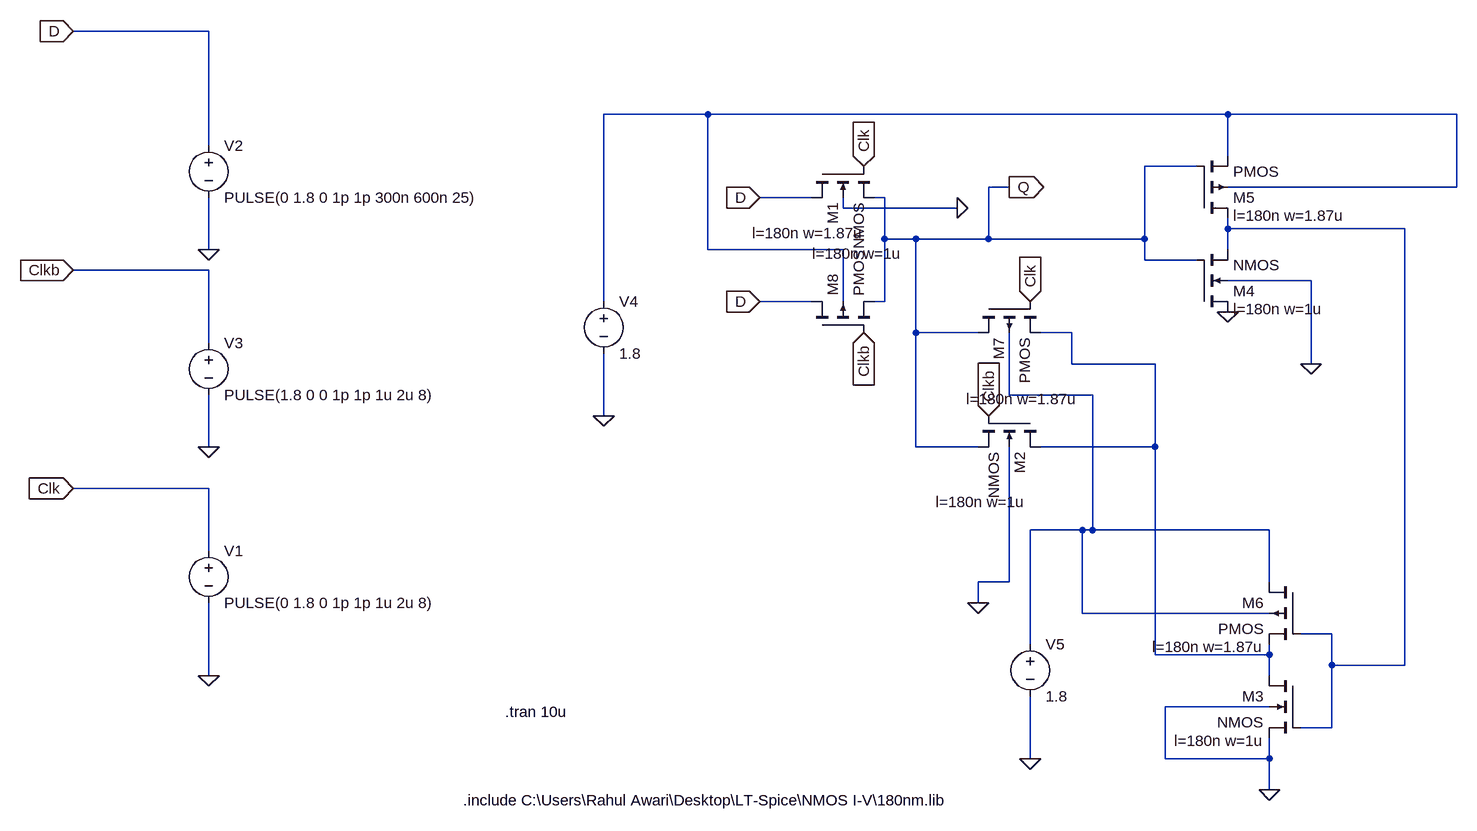
[diagram p0: schematic task4.asc]
task4.asc, the LTspice schematic file:
Version 4
SHEET 1 1328 704
WIRE -1040 -496 -1248 -496
WIRE -272 -368 -432 -368
WIRE 528 -368 -272 -368
WIRE 880 -368 528 -368
WIRE -1040 -320 -1040 -496
WIRE 528 -304 528 -368
WIRE 480 -288 400 -288
WIRE 192 -256 160 -256
WIRE 880 -256 880 -368
WIRE 880 -256 528 -256
WIRE -112 -240 -192 -240
WIRE 0 -240 -16 -240
WIRE -64 -224 -64 -240
WIRE 112 -224 -64 -224
WIRE 528 -192 528 -208
WIRE 800 -192 528 -192
WIRE 0 -176 0 -240
WIRE 48 -176 0 -176
WIRE 160 -176 160 -256
WIRE 160 -176 48 -176
WIRE 400 -176 400 -288
WIRE 400 -176 160 -176
WIRE -1040 -160 -1040 -240
WIRE -272 -160 -272 -368
WIRE -64 -160 -272 -160
WIRE 528 -160 528 -192
WIRE 400 -144 400 -176
WIRE 480 -144 400 -144
WIRE -1040 -128 -1248 -128
WIRE 656 -112 528 -112
WIRE -432 -80 -432 -368
WIRE -112 -80 -192 -80
WIRE -64 -80 -64 -160
WIRE 0 -80 0 -176
WIRE 0 -80 -16 -80
WIRE 48 -32 48 -176
WIRE 144 -32 48 -32
WIRE 288 -32 240 -32
WIRE -1040 -16 -1040 -128
WIRE 288 16 288 -32
WIRE 416 16 288 16
WIRE 656 16 656 -112
WIRE 192 64 192 -32
WIRE 320 64 192 64
WIRE -432 96 -432 0
WIRE -1040 144 -1040 64
WIRE 48 144 48 -32
WIRE 144 144 48 144
WIRE 416 144 416 16
WIRE 416 144 240 144
WIRE -1040 208 -1248 208
WIRE 304 272 224 272
WIRE 320 272 320 64
WIRE 320 272 304 272
WIRE 592 272 320 272
WIRE -1040 304 -1040 208
WIRE 192 352 192 144
WIRE 192 352 144 352
WIRE 592 352 592 272
WIRE 144 384 144 352
WIRE 304 400 304 272
WIRE 592 400 304 400
WIRE 688 432 640 432
WIRE 224 448 224 272
WIRE 416 464 416 144
WIRE 592 464 592 448
WIRE 592 464 416 464
WIRE 688 480 688 432
WIRE 800 480 800 -192
WIRE 800 480 688 480
WIRE -1040 496 -1040 384
WIRE 592 496 592 464
WIRE 592 544 432 544
WIRE 688 576 688 480
WIRE 688 576 640 576
WIRE 224 624 224 528
WIRE 432 624 432 544
WIRE 592 624 592 592
WIRE 592 624 432 624
WIRE 592 672 592 624
FLAG 528 -64 0
FLAG -192 -240 D
IOPIN -192 -240 In
FLAG -32 -32 Clkb
IOPIN -32 -32 In
FLAG 160 96 Clkb
IOPIN 160 96 In
FLAG -32 -288 Clk
IOPIN -32 -288 In
FLAG 224 -80 Clk
IOPIN 224 -80 In
FLAG 192 -256 Q
IOPIN 192 -256 Out
FLAG -1248 -496 D
IOPIN -1248 -496 In
FLAG -1248 -128 Clkb
IOPIN -1248 -128 In
FLAG -1040 -160 0
FLAG -1040 144 0
FLAG -1248 208 Clk
IOPIN -1248 208 In
FLAG -1040 496 0
FLAG -192 -80 D
IOPIN -192 -80 In
FLAG 656 16 0
FLAG 224 624 0
FLAG 592 672 0
FLAG 112 -224 0
FLAG 144 384 0
FLAG -432 96 0
SYMBOL nmos4 -112 -288 M90
WINDOW 123 134 139 VLeft 2
SYMATTR Value2 l=180n w=1u
SYMATTR InstName M1
SYMBOL nmos4 240 96 R90
WINDOW 123 133 23 VRight 2
SYMATTR Value2 l=180n w=1u
SYMATTR InstName M2
SYMBOL nmos4 640 496 M0
WINDOW 123 56 100 Left 2
SYMATTR Value2 l=180n w=1u
SYMATTR InstName M3
SYMBOL nmos4 480 -64 M180
WINDOW 123 56 4 Left 2
SYMATTR Value2 l=180n w=1u
SYMATTR InstName M4
SYMBOL pmos4 480 -208 M180
WINDOW 123 56 4 Left 2
SYMATTR Value2 l=180n w=1.87u
SYMATTR InstName M5
SYMBOL pmos4 640 352 M0
WINDOW 123 56 100 Left 2
SYMATTR Value2 l=180n w=1.87u
SYMATTR InstName M6
SYMBOL pmos4 144 -80 M90
WINDOW 123 150 154 VLeft 2
SYMATTR Value2 l=180n w=1.87u
SYMATTR InstName M7
SYMBOL pmos4 -112 -32 R270
WINDOW 123 153 -92 VRight 2
SYMATTR Value2 l=180n w=1.87u
SYMATTR InstName M8
SYMBOL voltage -1040 288 R0
WINDOW 123 0 0 Left 0
WINDOW 39 0 0 Left 0
SYMATTR InstName V1
SYMATTR Value PULSE(0 1.8 0 1p 1p 1u 2u 8)
SYMBOL voltage -1040 -336 R0
WINDOW 123 0 0 Left 0
WINDOW 39 0 0 Left 0
SYMATTR InstName V2
SYMATTR Value PULSE(0 1.8 0 1p 1p 300n 600n 25)
SYMBOL voltage -1040 -32 R0
WINDOW 123 0 0 Left 0
WINDOW 39 0 0 Left 0
SYMATTR InstName V3
SYMATTR Value PULSE(1.8 0 0 1p 1p 1u 2u 8)
SYMBOL voltage 224 432 R0
WINDOW 123 0 0 Left 0
WINDOW 39 0 0 Left 0
SYMATTR InstName V5
SYMATTR Value 1.8
SYMBOL voltage -432 -96 R0
WINDOW 123 0 0 Left 0
WINDOW 39 0 0 Left 0
SYMATTR InstName V4
SYMATTR Value 1.8
TEXT -584 552 Left 2 !.tran 10u
TEXT -648 688 Left 2 !.include C:\\Users\\Rahul Awari\\Desktop\\LT-Spice\\NMOS I-V\\180nm.lib

The netlist it stands for:
* task4.asc
M1 D Clk Q 0 NMOS l=180n w=1u
M2 N003 Clkb Q 0 NMOS l=180n w=1u
M3 N003 N002 0 0 NMOS l=180n w=1u
M4 0 Q N002 0 NMOS l=180n w=1u
M5 N002 Q N001 N001 PMOS l=180n w=1.87u
M6 N004 N002 N003 N004 PMOS l=180n w=1.87u
M7 Q Clk N003 N004 PMOS l=180n w=1.87u
M8 D Clkb Q N001 PMOS l=180n w=1.87u
V1 Clk 0 PULSE(0 1.8 0 1p 1p 1u 2u 8)
V2 D 0 PULSE(0 1.8 0 1p 1p 300n 600n 25)
V3 Clkb 0 PULSE(1.8 0 0 1p 1p 1u 2u 8)
V5 N004 0 1.8
V4 N001 0 1.8
.model NMOS NMOS
.model PMOS PMOS
.lib standard.mos
.tran 10u
.include C:\Users\Rahul Awari\Desktop\LT-Spice\NMOS I-V\180nm.lib
.backanno
.end